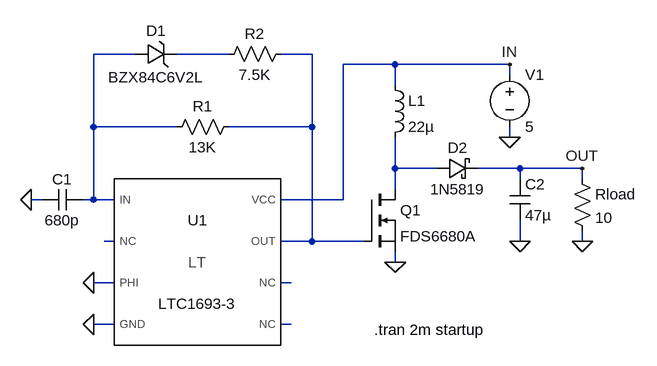
[diagram p0: schematic 1693-3.asc]
1693-3.asc, the LTspice schematic file:
Version 4
SHEET 1 2388 1428
WIRE 1472 848 1408 848
WIRE 1616 848 1536 848
WIRE 1744 848 1696 848
WIRE 1872 864 1792 864
WIRE 2048 864 1872 864
WIRE 2048 880 2048 864
WIRE 1872 896 1872 864
WIRE 1408 960 1408 848
WIRE 1536 960 1408 960
WIRE 1744 960 1744 848
WIRE 1744 960 1616 960
WIRE 2048 976 2048 960
WIRE 1872 1024 1872 976
WIRE 1936 1024 1872 1024
WIRE 2064 1024 2000 1024
WIRE 2160 1024 2064 1024
WIRE 2064 1040 2064 1024
WIRE 2160 1040 2160 1024
WIRE 1872 1056 1872 1024
WIRE 1328 1072 1312 1072
WIRE 1408 1072 1408 960
WIRE 1408 1072 1392 1072
WIRE 1440 1072 1408 1072
WIRE 1792 1072 1792 864
WIRE 1792 1072 1696 1072
WIRE 1440 1136 1424 1136
WIRE 1744 1136 1744 960
WIRE 1744 1136 1696 1136
WIRE 1824 1136 1744 1136
WIRE 2064 1136 2064 1104
WIRE 2160 1136 2160 1120
WIRE 1872 1168 1872 1152
WIRE 1440 1200 1408 1200
WIRE 1712 1200 1696 1200
WIRE 1440 1264 1408 1264
WIRE 1712 1264 1696 1264
FLAG 2048 976 0
FLAG 1408 1264 0
FLAG 1312 1072 0
FLAG 1872 1168 0
FLAG 2064 1136 0
FLAG 2160 1136 0
FLAG 2160 1024 OUT
FLAG 2048 864 IN
FLAG 1408 1200 0
SYMBOL POWERPRODUCTS\\LTC1693-3 1568 1168 R0
SYMATTR InstName U1
SYMBOL RES 1632 944 R90
WINDOW 0 0 56 VBottom 2
WINDOW 3 32 56 VTop 2
SYMATTR InstName R1
SYMATTR Value 13K
SYMBOL res 1712 832 R90
WINDOW 0 0 56 VBottom 2
WINDOW 3 32 56 VTop 2
SYMATTR InstName R2
SYMATTR Value 7.5K
SYMBOL cap 1392 1056 R90
WINDOW 0 0 32 VBottom 2
WINDOW 3 32 32 VTop 2
SYMATTR InstName C1
SYMATTR Value 680p
SYMBOL zener 1472 864 R270
WINDOW 0 36 32 VTop 2
WINDOW 3 -4 32 VBottom 2
SYMATTR InstName D1
SYMATTR Value BZX84C6V2L
SYMBOL NMOS 1824 1056 R0
SYMATTR InstName Q1
SYMATTR Value FDS6680A
SYMBOL ind 1856 880 R0
SYMATTR InstName L1
SYMATTR Value 22µ
SYMBOL schottky 1936 1040 R270
WINDOW 0 32 32 VTop 2
WINDOW 3 0 32 VBottom 2
SYMATTR InstName D2
SYMATTR Value 1N5819
SYMBOL cap 2048 1040 R0
SYMATTR InstName C2
SYMATTR Value 47µ
SYMBOL res 2144 1024 R0
SYMATTR InstName Rload
SYMATTR Value 10
SYMBOL voltage 2048 864 R0
SYMATTR InstName V1
SYMATTR Value 5
TEXT 1840 1272 Left 2 !.tran 2m startup

The netlist it stands for:
* 1693-3.asc
XU1 N001 N005 0 0 N007 N006 N003 IN LTC1693-3  ; pins IN NC PHI GND NC NC OUT VCC
R1 N003 N001 13K
R2 N003 N002 7.5K
C1 N001 0 680p
D1 N001 N002 BZX84C6V2L
M§Q1 N004 N003 0 0 FDS6680A
L1 IN N004 22µ
D2 N004 OUT 1N5819
C2 OUT 0 47µ
Rload OUT 0 10
V1 IN 0 5
.model D D
.lib standard.dio
.model NMOS NMOS
.model PMOS PMOS
.lib standard.mos
.tran 2m startup
.lib LTC1693-3.sub
.backanno
.end